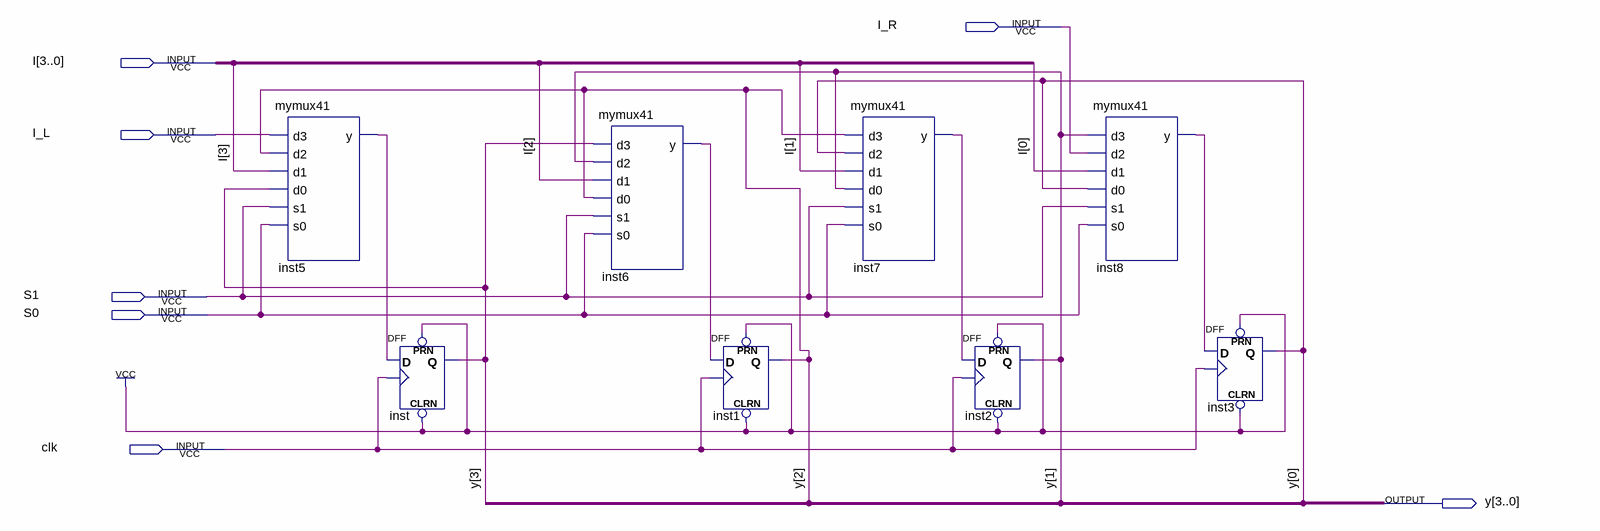
[diagram p0: schematic sheet]
// Quartus schematic accumulator.bdf as structural Verilog: 8 symbols, 7 pins
module accumulator (
  input  I_R,
  input  [3:0] I,
  input  I_L,
  input  S1,
  input  S0,
  input  clk,
  output [3:0] y
);

  wire inst5_y, inst6_y, inst7_y, inst8_y;

  mymux41 inst5 (.d3(I_L), .d2(y[2]), .d1(I[3]), .d0(y[3]), .s1(S1), .s0(S0), .y(inst5_y));
  DFF inst (.CLRN(1'b1), .CLK(clk), .D(inst5_y), .PRN(1'b1), .Q(y[3]));
  mymux41 inst6 (.d3(y[3]), .d2(y[1]), .d1(I[2]), .d0(y[2]), .s1(S1), .s0(S0), .y(inst6_y));
  DFF inst1 (.CLRN(1'b1), .CLK(clk), .D(inst6_y), .PRN(1'b1), .Q(y[2]));
  mymux41 inst7 (.d3(y[2]), .d2(y[0]), .d1(I[1]), .d0(y[1]), .s1(S1), .s0(S0), .y(inst7_y));
  DFF inst2 (.CLRN(1'b1), .CLK(clk), .D(inst7_y), .PRN(1'b1), .Q(y[1]));
  mymux41 inst8 (.d3(y[1]), .d2(I_R), .d1(I[0]), .d0(y[0]), .s1(S1), .s0(S0), .y(inst8_y));
  DFF inst3 (.CLRN(1'b1), .CLK(clk), .D(inst8_y), .PRN(1'b1), .Q(y[0]));
endmodule
